# Altium project PROJECT-ADG3300-BREAKOUT.PrjPcb
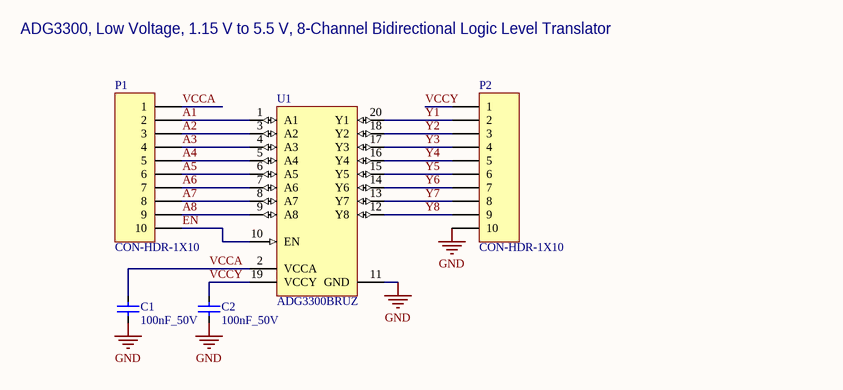
[diagram p0: ADG3300-BREAKOUT.SchDoc]
1 sheet, 5 parts. Net scope: global (net labels, ports and power ports of the same name join across sheets).
Board file: ADG3300-BREAKOUT.PcbDoc

## Sheet ADG3300-BREAKOUT.SchDoc: AD3300 Bidirectional Level Shifter
size A4; Author: Meysam Parvizi; DrawnBy: Meysam Parvizi; SheetNumber: 1; SheetTotal: 1

### Parts
C1  value 100nF_50V  [C0805]  (hidden comment: CC0805KRX7R9BB104)
C2  value 100nF_50V  [C0805]  (hidden comment: CC0805KRX7R9BB104)
P1  CON-HDR-1X10  [CON-HDR-1X10-2.54]
P2  CON-HDR-1X10  [CON-HDR-1X10-2.54]
U1  ADG3300BRUZ  [TSSOP-20]

### Nets
GND: C1.2 C2.2 P2.10 U1.11(GND)
A1: P1.2 U1.1(A1)
A2: P1.3 U1.3(A2)
A3: P1.4 U1.4(A3)
A4: P1.5 U1.5(A4)
A5: P1.6 U1.6(A5)
A6: P1.7 U1.7(A6)
A7: P1.8 U1.8(A7)
A8: P1.9 U1.9(A8)
EN: P1.10 U1.10(EN)
VCCA: C1.1 P1.1 U1.2(VCCA)
VCCY: C2.1 P2.1 U1.19(VCCY)
Y1: P2.2 U1.20(Y1)
Y2: P2.3 U1.18(Y2)
Y3: P2.4 U1.17(Y3)
Y4: P2.5 U1.16(Y4)
Y5: P2.6 U1.15(Y5)
Y6: P2.7 U1.14(Y6)
Y7: P2.8 U1.13(Y7)
Y8: P2.9 U1.12(Y8)

### Notes on the sheet
- ADG3300, Low Voltage, 1.15 V to 5.5 V, 8-Channel Bidirectional Logic Level Translator
- Title:
- Designed By:
- Meysam Parvizi
- GitHub:
- https://github.com/m3y54m
- File:
- Project Git Hash:
- Project:
- Date:
- Sheet
- Revision:
- of
- Size:
- A4
- File Git Hash:

### Library data of the parts
C1 C2 = CAPACITOR: 50V 100nF X7R ±10% 0805 Multilayer Ceramic Capacitors MLCC - SMD/SMT ROHS; Manufacturer: YAGEO; Package: 0805; Mounting: SMD; Category: Capacitor
P1 P2 = CON-HDR-1X10: Pin Header, 10-Pin; LatestRevisionDate: 17-Jul-2002; LatestRevisionNote: Re-released for DXP Platform.; Publisher: Altium Limited
U1 = ADG3300: Low Voltage 1.15 V to 5.5 V, 8-Channel Bidirectional Logic Level Translator, -40 to 85 degC, 20-pin SOP (RU-20), Tube; Manufacturer: Analog Devices; Bus Enable Time (typ): 1us; Mounting Technology: Surface Mount; DatasheetVersion: Rev. 0; ComponentLink1Description: Manufacturer URL; ComponentLink2URL: http://www.analog.com/static/imported-files/data_sheets/ADG3300.pdf; PackageVersion: Jan-03; ComponentLink2Description: Datasheet; PackageReference: RU-20; ComponentLink3URL: http://www.analog.com/static/imported-files/packages/364515793657813558433715854054607941441RU20.pdf; PackageDescription: 20-Pin Thin Shrink Small Outline Package, Body 6.5 x 4.4 mm, Pitch 0.65 mm; PartNumber: ADG3300BRUZ; Code_JEDEC: MO-153AC; ComponentLink3Description: Package Specification; ComponentLink1URL: http://www.analog.com/en/index.html